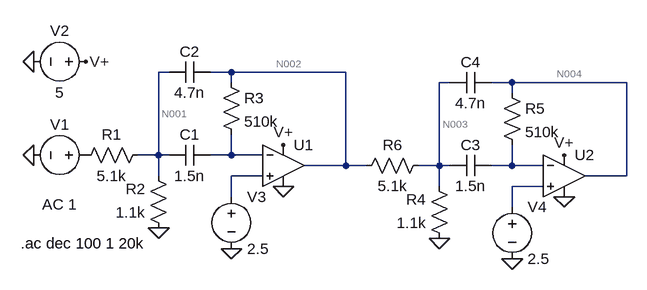
[diagram p0: schematic MFB.asc]
MFB.asc, the LTspice schematic file:
Version 4
SHEET 1 880 680
WIRE 16 48 0 48
WIRE 112 48 80 48
WIRE 288 48 112 48
WIRE 112 64 112 48
WIRE 448 64 432 64
WIRE 544 64 512 64
WIRE 720 64 544 64
WIRE 544 80 544 64
WIRE 0 176 0 48
WIRE 0 176 -32 176
WIRE 16 176 0 176
WIRE 112 176 112 144
WIRE 112 176 80 176
WIRE 160 176 112 176
WIRE 288 192 288 48
WIRE 288 192 224 192
WIRE 320 192 288 192
WIRE 432 192 432 64
WIRE 432 192 400 192
WIRE 448 192 432 192
WIRE 544 192 544 160
WIRE 544 192 512 192
WIRE 592 192 544 192
WIRE 0 208 0 176
WIRE 160 208 112 208
WIRE 720 208 720 64
WIRE 720 208 656 208
WIRE 432 224 432 192
WIRE 592 224 544 224
WIRE 112 240 112 208
WIRE 544 256 544 224
FLAG 192 224 0
FLAG 0 288 0
FLAG -192 176 0
FLAG -192 32 0
FLAG -112 32 V+
FLAG 192 160 V+
FLAG 112 320 0
FLAG 624 240 0
FLAG 432 304 0
FLAG 624 176 V+
FLAG 544 336 0
SYMBOL OpAmps\\UniversalOpAmp2 192 192 R0
SYMATTR InstName U1
SYMBOL res -16 160 R90
WINDOW 0 0 56 VBottom 2
WINDOW 3 32 56 VTop 2
SYMATTR InstName R1
SYMATTR Value 5.1k
SYMBOL res 16 304 R180
WINDOW 0 36 76 Left 2
WINDOW 3 36 40 Left 2
SYMATTR InstName R2
SYMATTR Value 1.1k
SYMBOL cap 80 160 R90
WINDOW 0 0 32 VBottom 2
WINDOW 3 32 32 VTop 2
SYMATTR InstName C1
SYMATTR Value 1.5n
SYMBOL cap 80 32 R90
WINDOW 0 0 32 VBottom 2
WINDOW 3 32 32 VTop 2
SYMATTR InstName C2
SYMATTR Value 4.7n
SYMBOL res 96 48 R0
SYMATTR InstName R3
SYMATTR Value 510k
SYMBOL voltage -96 176 R90
WINDOW 0 -32 56 VBottom 2
WINDOW 3 32 56 VTop 2
WINDOW 123 60 56 VTop 2
WINDOW 39 0 0 Left 0
SYMATTR InstName V1
SYMATTR Value ""
SYMATTR Value2 AC 1
SYMBOL voltage -96 32 R90
WINDOW 0 -32 56 VBottom 2
WINDOW 3 32 56 VTop 2
WINDOW 123 0 0 Left 0
WINDOW 39 0 0 Left 0
SYMATTR InstName V2
SYMATTR Value 5
SYMBOL voltage 112 224 R0
WINDOW 123 0 0 Left 0
WINDOW 39 0 0 Left 0
SYMATTR InstName V3
SYMATTR Value 2.5
SYMBOL OpAmps\\UniversalOpAmp2 624 208 R0
SYMATTR InstName U2
SYMBOL res 448 320 R180
WINDOW 0 36 76 Left 2
WINDOW 3 36 40 Left 2
SYMATTR InstName R4
SYMATTR Value 1.1k
SYMBOL cap 512 176 R90
WINDOW 0 0 32 VBottom 2
WINDOW 3 32 32 VTop 2
SYMATTR InstName C3
SYMATTR Value 1.5n
SYMBOL cap 512 48 R90
WINDOW 0 0 32 VBottom 2
WINDOW 3 32 32 VTop 2
SYMATTR InstName C4
SYMATTR Value 4.7n
SYMBOL res 528 64 R0
SYMATTR InstName R5
SYMATTR Value 510k
SYMBOL voltage 544 240 R0
WINDOW 123 0 0 Left 0
WINDOW 39 0 0 Left 0
SYMATTR InstName V4
SYMATTR Value 2.5
SYMBOL res 416 176 R90
WINDOW 0 0 56 VBottom 2
WINDOW 3 32 56 VTop 2
SYMATTR InstName R6
SYMATTR Value 5.1k
TEXT -212 312 Left 2 !.ac dec 100 1 20k

The netlist it stands for:
* MFB.asc
XU1 N007 N005 V+ 0 N002 level2 Avol=1Meg GBW=10Meg Slew=10Meg Ilimit=25m Rail=0 Vos=0 En=0 Enk=0 In=0 Ink=0 Rin=500Meg  ; pins In+ In- V+ V- OUT
R1 N001 P001 5.1k
R2 0 N001 1.1k
C1 N005 N001 1.5n
C2 N002 N001 4.7n
R3 N002 N005 510k
V1 P001 0 AC 1
V2 V+ 0 5
V3 N007 0 2.5
XU2 N008 N006 V+ 0 N004 level2 Avol=1Meg GBW=10Meg Slew=10Meg Ilimit=25m Rail=0 Vos=0 En=0 Enk=0 In=0 Ink=0 Rin=500Meg  ; pins In+ In- V+ V- OUT
R4 0 N003 1.1k
C3 N006 N003 1.5n
C4 N004 N003 4.7n
R5 N004 N006 510k
V4 N008 0 2.5
R6 N003 N002 5.1k
.ac dec 100 1 20k
.lib UniversalOpAmp2.lib
.backanno
.end

* Results of the author's LTspice run, read from the files saved beside the schematic
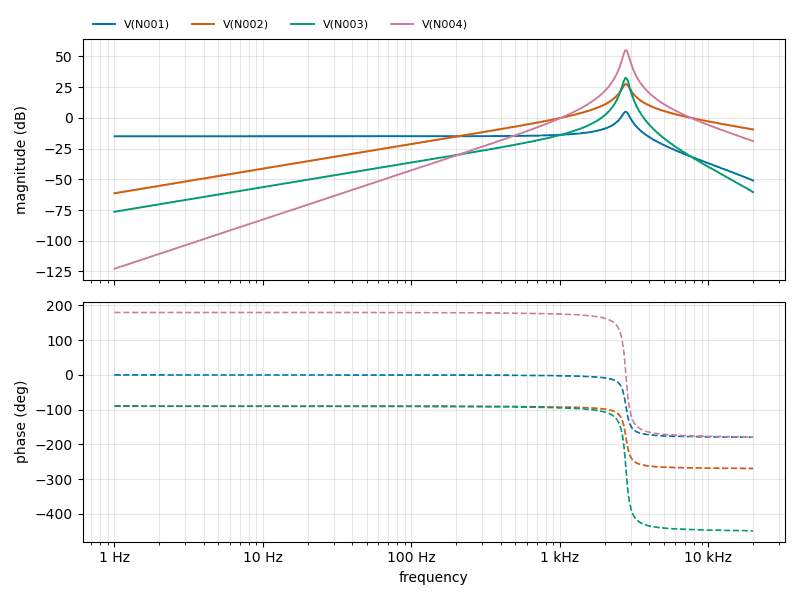
[diagram p1: AC Analysis of MFB.asc, plotted from the saved traces]
* AC Analysis, 1 run:
*   V(N001): -15.02 dB at 1 Hz, -50.99 dB at 20 kHz, peak 4.99 dB at 2.754 kHz, 3 dB below the peak at 2.634 kHz and 2.915 kHz
*   V(N002): -61.38 dB at 1 Hz, -9.44 dB at 20 kHz, peak 27.46 dB at 2.754 kHz, 3 dB below the peak at 2.645 kHz and 2.932 kHz
*   V(N003): -76.40 dB at 1 Hz, -60.41 dB at 20 kHz, peak 32.45 dB at 2.754 kHz, 3 dB below the peak at 2.688 kHz and 2.874 kHz
*   V(N004): -122.77 dB at 1 Hz, -18.88 dB at 20 kHz, peak 54.92 dB at 2.754 kHz, 3 dB below the peak at 2.691 kHz and 2.882 kHz